# Altium project FMC_HPC_TO_LPC_BREAKOUT.PrjPcb
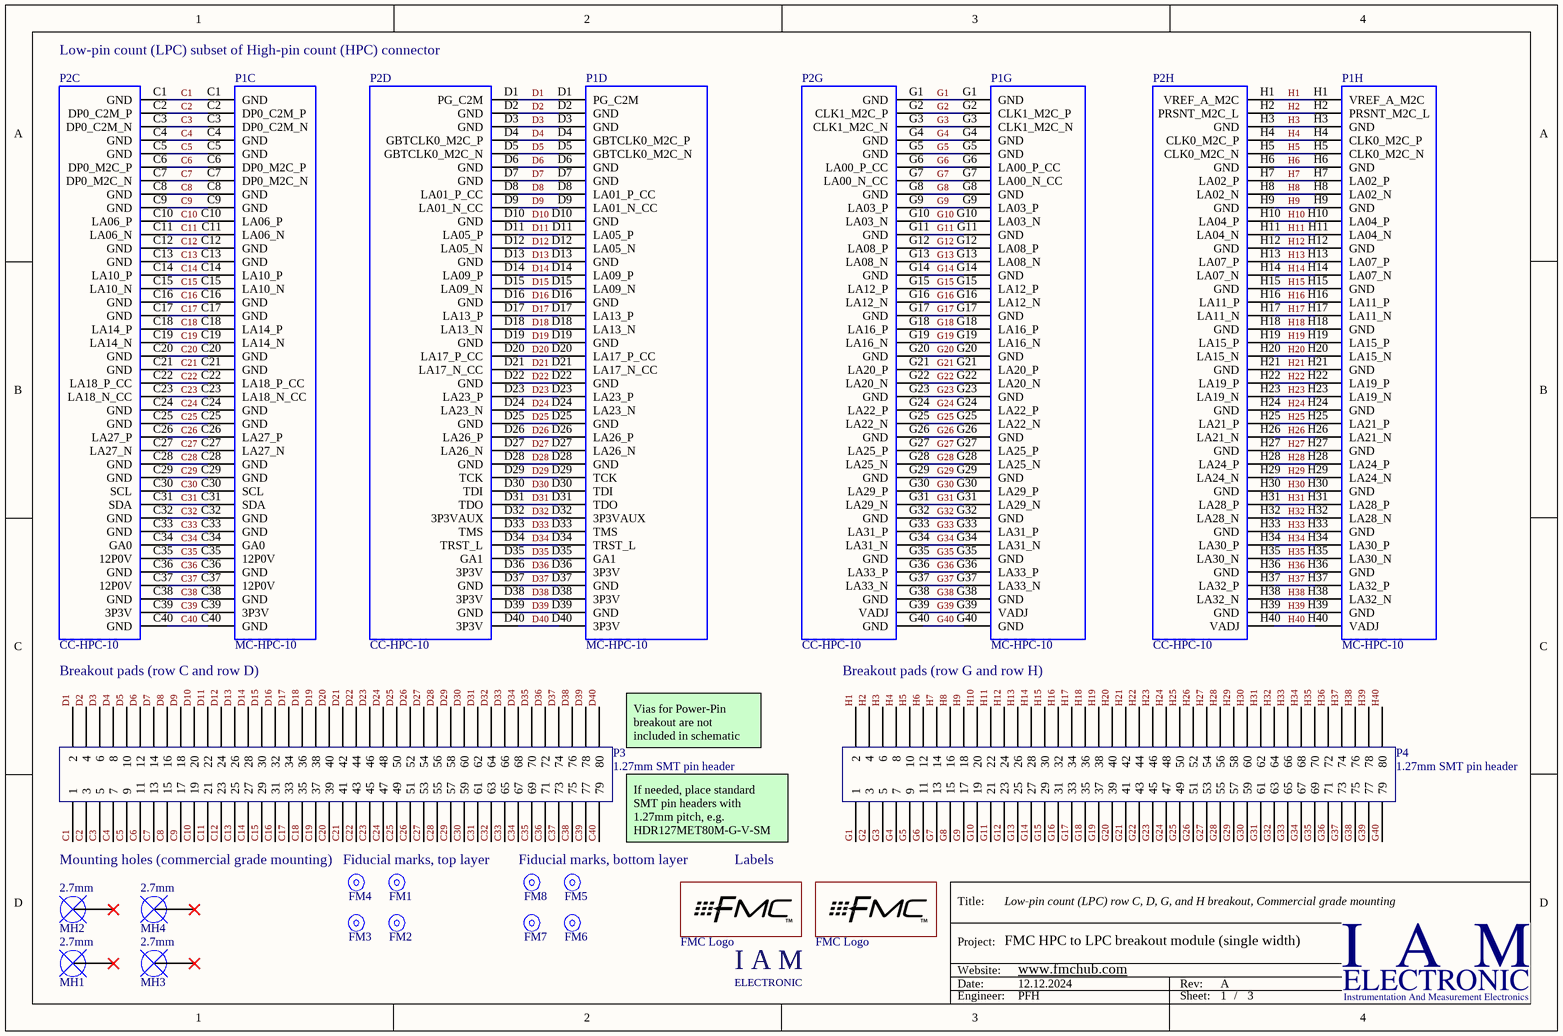
[diagram p0: FMC_HPC_TO_LPC_BREAKOUT_REVA.SchDoc]
3 sheets, 19 parts. Net scope: global (net labels, ports and power ports of the same name join across sheets).
Board file: FMC_HPC_TO_LPC_BREAKOUT.PcbDoc
Sheets:
  FMC_HPC_TO_LPC_BREAKOUT_REVA.SchDoc
  FMC_HPC_TO_LPC_BREAKOUT_ROW_HPC1.SchDoc
  FMC_HPC_TO_LPC_BREAKOUT_ROW_HPC2.SchDoc

## Sheet FMC_HPC_TO_LPC_BREAKOUT_REVA.SchDoc: Low-pin count (LPC) row C, D, G, and H breakout, Commercial grade mounting
size A4; Date: 12.12.2024; DrawnBy: PFH; Engineer: PFH; DocumentNumber: 1; Revision: A; SheetNumber: 1; SheetTotal: 3; Projekt: FMC HPC to LPC breakout module (single width); Website: www.fmchub.com; ProjectName: FMC_Single_LPC_BREAKOUT

### Parts
FM1  1mm  [FIDUCIAL_MARK_ROUND_RING]  (value not drawn)  (no BOM)
FM2  1mm  [FIDUCIAL_MARK_ROUND_RING]  (value not drawn)  (no BOM)
FM3  1mm  [FIDUCIAL_MARK_ROUND_RING]  (value not drawn)  (no BOM)
FM4  1mm  [FIDUCIAL_MARK_ROUND_RING]  (value not drawn)  (no BOM)
FM5  1mm  [FIDUCIAL_MARK_ROUND_RING]  (value not drawn)  (no BOM)
FM6  1mm  [FIDUCIAL_MARK_ROUND_RING]  (value not drawn)  (no BOM)
FM7  1mm  [FIDUCIAL_MARK_ROUND_RING]  (value not drawn)  (no BOM)
FM8  1mm  [FIDUCIAL_MARK_ROUND_RING]  (value not drawn)  (no BOM)
MH1  2.7mm  [Mounting_Hole_Plated_2.7mm - d3.1mm]  (no BOM)
MH2  2.7mm  [Mounting_Hole_Plated_2.7mm - d3.1mm]  (no BOM)
MH3  2.7mm  [Mounting_Hole_Plated_2.7mm-COVERED]  (no BOM)
MH4  2.7mm  [Mounting_Hole_Plated_2.7mm-COVERED]  (no BOM)
P1  MC-HPC-10  [ASP-134488-01]  (parts C,D,G,H of 10)
P2  CC-HPC-10  [ASP-134486-01]  (parts C,D,G,H of 10)
P3  1.27mm SMT pin header  [FTS-140-01-L-DV-A_NO_PASTE]
P4  1.27mm SMT pin header  [FTS-140-01-L-DV-A_NO_PASTE]
STR1  IAM LOGO  [IAM LOGO - MEDIUM]  (value not drawn)  (no BOM)
STR2  FMC Logo  [FMC_TM_LOGO_SMALL]  (no BOM)
STR3  FMC Logo  [FMC_TM_LOGO_SMALL]  (no BOM)

### Nets
C1: P1.C1(GND) P2.C1(GND) P3.1
C2: P1.C2(DP0_C2M_P) P2.C2(DP0_C2M_P) P3.3
C3: P1.C3(DP0_C2M_N) P2.C3(DP0_C2M_N) P3.5
C4: P1.C4(GND) P2.C4(GND) P3.7
C5: P1.C5(GND) P2.C5(GND) P3.9
C6: P1.C6(DP0_M2C_P) P2.C6(DP0_M2C_P) P3.11
C7: P1.C7(DP0_M2C_N) P2.C7(DP0_M2C_N) P3.13
C8: P1.C8(GND) P2.C8(GND) P3.15
C9: P1.C9(GND) P2.C9(GND) P3.17
C10: P1.C10(LA06_P) P2.C10(LA06_P) P3.19
C11: P1.C11(LA06_N) P2.C11(LA06_N) P3.21
C12: P1.C12(GND) P2.C12(GND) P3.23
C13: P1.C13(GND) P2.C13(GND) P3.25
C14: P1.C14(LA10_P) P2.C14(LA10_P) P3.27
C15: P1.C15(LA10_N) P2.C15(LA10_N) P3.29
C16: P1.C16(GND) P2.C16(GND) P3.31
C17: P1.C17(GND) P2.C17(GND) P3.33
C18: P1.C18(LA14_P) P2.C18(LA14_P) P3.35
C19: P1.C19(LA14_N) P2.C19(LA14_N) P3.37
C20: P1.C20(GND) P2.C20(GND) P3.39
C21: P1.C21(GND) P2.C21(GND) P3.41
C22: P1.C22(LA18_P_CC) P2.C22(LA18_P_CC) P3.43
C23: P1.C23(LA18_N_CC) P2.C23(LA18_N_CC) P3.45
C24: P1.C24(GND) P2.C24(GND) P3.47
C25: P1.C25(GND) P2.C25(GND) P3.49
C26: P1.C26(LA27_P) P2.C26(LA27_P) P3.51
C27: P1.C27(LA27_N) P2.C27(LA27_N) P3.53
C28: P1.C28(GND) P2.C28(GND) P3.55
C29: P1.C29(GND) P2.C29(GND) P3.57
C30: P1.C30(SCL) P2.C30(SCL) P3.59
C31: P1.C31(SDA) P2.C31(SDA) P3.61
C32: P1.C32(GND) P2.C32(GND) P3.63
C33: P1.C33(GND) P2.C33(GND) P3.65
C34: P1.C34(GA0) P2.C34(GA0) P3.67
C35: P1.C35(12P0V) P2.C35(12P0V) P3.69
C36: P1.C36(GND) P2.C36(GND) P3.71
C37: P1.C37(12P0V) P2.C37(12P0V) P3.73
C38: P1.C38(GND) P2.C38(GND) P3.75
C39: P1.C39(3P3V) P2.C39(3P3V) P3.77
C40: P1.C40(GND) P2.C40(GND) P3.79
D1: P1.D1(PG_C2M) P2.D1(PG_C2M) P3.2
D2: P1.D2(GND) P2.D2(GND) P3.4
D3: P1.D3(GND) P2.D3(GND) P3.6
D4: P1.D4(GBTCLK0_M2C_P) P2.D4(GBTCLK0_M2C_P) P3.8
D5: P1.D5(GBTCLK0_M2C_N) P2.D5(GBTCLK0_M2C_N) P3.10
D6: P1.D6(GND) P2.D6(GND) P3.12
D7: P1.D7(GND) P2.D7(GND) P3.14
D8: P1.D8(LA01_P_CC) P2.D8(LA01_P_CC) P3.16
D9: P1.D9(LA01_N_CC) P2.D9(LA01_N_CC) P3.18
D10: P1.D10(GND) P2.D10(GND) P3.20
D11: P1.D11(LA05_P) P2.D11(LA05_P) P3.22
D12: P1.D12(LA05_N) P2.D12(LA05_N) P3.24
D13: P1.D13(GND) P2.D13(GND) P3.26
D14: P1.D14(LA09_P) P2.D14(LA09_P) P3.28
D15: P1.D15(LA09_N) P2.D15(LA09_N) P3.30
D16: P1.D16(GND) P2.D16(GND) P3.32
D17: P1.D17(LA13_P) P2.D17(LA13_P) P3.34
D18: P1.D18(LA13_N) P2.D18(LA13_N) P3.36
D19: P1.D19(GND) P2.D19(GND) P3.38
D20: P1.D20(LA17_P_CC) P2.D20(LA17_P_CC) P3.40
D21: P1.D21(LA17_N_CC) P2.D21(LA17_N_CC) P3.42
D22: P1.D22(GND) P2.D22(GND) P3.44
D23: P1.D23(LA23_P) P2.D23(LA23_P) P3.46
D24: P1.D24(LA23_N) P2.D24(LA23_N) P3.48
D25: P1.D25(GND) P2.D25(GND) P3.50
D26: P1.D26(LA26_P) P2.D26(LA26_P) P3.52
D27: P1.D27(LA26_N) P2.D27(LA26_N) P3.54
D28: P1.D28(GND) P2.D28(GND) P3.56
D29: P1.D29(TCK) P2.D29(TCK) P3.58
D30: P1.D30(TDI) P2.D30(TDI) P3.60
D31: P1.D31(TDO) P2.D31(TDO) P3.62
D32: P1.D32(3P3VAUX) P2.D32(3P3VAUX) P3.64
D33: P1.D33(TMS) P2.D33(TMS) P3.66
D34: P1.D34(TRST_L) P2.D34(TRST_L) P3.68
D35: P1.D35(GA1) P2.D35(GA1) P3.70
D36: P1.D36(3P3V) P2.D36(3P3V) P3.72
D37: P1.D37(GND) P2.D37(GND) P3.74
D38: P1.D38(3P3V) P2.D38(3P3V) P3.76
D39: P1.D39(GND) P2.D39(GND) P3.78
D40: P1.D40(3P3V) P2.D40(3P3V) P3.80
G1: P1.G1(GND) P2.G1(GND) P4.1
G2: P1.G2(CLK1_M2C_P) P2.G2(CLK1_M2C_P) P4.3
G3: P1.G3(CLK1_M2C_N) P2.G3(CLK1_M2C_N) P4.5
G4: P1.G4(GND) P2.G4(GND) P4.7
G5: P1.G5(GND) P2.G5(GND) P4.9
G6: P1.G6(LA00_P_CC) P2.G6(LA00_P_CC) P4.11
G7: P1.G7(LA00_N_CC) P2.G7(LA00_N_CC) P4.13
G8: P1.G8(GND) P2.G8(GND) P4.15
G9: P1.G9(LA03_P) P2.G9(LA03_P) P4.17
G10: P1.G10(LA03_N) P2.G10(LA03_N) P4.19
G11: P1.G11(GND) P2.G11(GND) P4.21
G12: P1.G12(LA08_P) P2.G12(LA08_P) P4.23
G13: P1.G13(LA08_N) P2.G13(LA08_N) P4.25
G14: P1.G14(GND) P2.G14(GND) P4.27
G15: P1.G15(LA12_P) P2.G15(LA12_P) P4.29
G16: P1.G16(LA12_N) P2.G16(LA12_N) P4.31
G17: P1.G17(GND) P2.G17(GND) P4.33
G18: P1.G18(LA16_P) P2.G18(LA16_P) P4.35
G19: P1.G19(LA16_N) P2.G19(LA16_N) P4.37
G20: P1.G20(GND) P2.G20(GND) P4.39
G21: P1.G21(LA20_P) P2.G21(LA20_P) P4.41
G22: P1.G22(LA20_N) P2.G22(LA20_N) P4.43
G23: P1.G23(GND) P2.G23(GND) P4.45
G24: P1.G24(LA22_P) P2.G24(LA22_P) P4.47
G25: P1.G25(LA22_N) P2.G25(LA22_N) P4.49
G26: P1.G26(GND) P2.G26(GND) P4.51
G27: P1.G27(LA25_P) P2.G27(LA25_P) P4.53
G28: P1.G28(LA25_N) P2.G28(LA25_N) P4.55
G29: P1.G29(GND) P2.G29(GND) P4.57
G30: P1.G30(LA29_P) P2.G30(LA29_P) P4.59
G31: P1.G31(LA29_N) P2.G31(LA29_N) P4.61
G32: P1.G32(GND) P2.G32(GND) P4.63
G33: P1.G33(LA31_P) P2.G33(LA31_P) P4.65
G34: P1.G34(LA31_N) P2.G34(LA31_N) P4.67
G35: P1.G35(GND) P2.G35(GND) P4.69
G36: P1.G36(LA33_P) P2.G36(LA33_P) P4.71
G37: P1.G37(LA33_N) P2.G37(LA33_N) P4.73
G38: P1.G38(GND) P2.G38(GND) P4.75
G39: P1.G39(VADJ) P2.G39(VADJ) P4.77
G40: P1.G40(GND) P2.G40(GND) P4.79
H1: P1.H1(VREF_A_M2C) P2.H1(VREF_A_M2C) P4.2
H2: P1.H2(PRSNT_M2C_L) P2.H2(PRSNT_M2C_L) P4.4
H3: P1.H3(GND) P2.H3(GND) P4.6
H4: P1.H4(CLK0_M2C_P) P2.H4(CLK0_M2C_P) P4.8
H5: P1.H5(CLK0_M2C_N) P2.H5(CLK0_M2C_N) P4.10
H6: P1.H6(GND) P2.H6(GND) P4.12
H7: P1.H7(LA02_P) P2.H7(LA02_P) P4.14
H8: P1.H8(LA02_N) P2.H8(LA02_N) P4.16
H9: P1.H9(GND) P2.H9(GND) P4.18
H10: P1.H10(LA04_P) P2.H10(LA04_P) P4.20
H11: P1.H11(LA04_N) P2.H11(LA04_N) P4.22
H12: P1.H12(GND) P2.H12(GND) P4.24
H13: P1.H13(LA07_P) P2.H13(LA07_P) P4.26
H14: P1.H14(LA07_N) P2.H14(LA07_N) P4.28
H15: P1.H15(GND) P2.H15(GND) P4.30
H16: P1.H16(LA11_P) P2.H16(LA11_P) P4.32
H17: P1.H17(LA11_N) P2.H17(LA11_N) P4.34
H18: P1.H18(GND) P2.H18(GND) P4.36
H19: P1.H19(LA15_P) P2.H19(LA15_P) P4.38
H20: P1.H20(LA15_N) P2.H20(LA15_N) P4.40
H21: P1.H21(GND) P2.H21(GND) P4.42
H22: P1.H22(LA19_P) P2.H22(LA19_P) P4.44
H23: P1.H23(LA19_N) P2.H23(LA19_N) P4.46
H24: P1.H24(GND) P2.H24(GND) P4.48
H25: P1.H25(LA21_P) P2.H25(LA21_P) P4.50
H26: P1.H26(LA21_N) P2.H26(LA21_N) P4.52
H27: P1.H27(GND) P2.H27(GND) P4.54
H28: P1.H28(LA24_P) P2.H28(LA24_P) P4.56
H29: P1.H29(LA24_N) P2.H29(LA24_N) P4.58
H30: P1.H30(GND) P2.H30(GND) P4.60
H31: P1.H31(LA28_P) P2.H31(LA28_P) P4.62
H32: P1.H32(LA28_N) P2.H32(LA28_N) P4.64
H33: P1.H33(GND) P2.H33(GND) P4.66
H34: P1.H34(LA30_P) P2.H34(LA30_P) P4.68
H35: P1.H35(LA30_N) P2.H35(LA30_N) P4.70
H36: P1.H36(GND) P2.H36(GND) P4.72
H37: P1.H37(LA32_P) P2.H37(LA32_P) P4.74
H38: P1.H38(LA32_N) P2.H38(LA32_N) P4.76
H39: P1.H39(GND) P2.H39(GND) P4.78
H40: P1.H40(VADJ) P2.H40(VADJ) P4.80

Not connected (* = marked no-connect by the designer): FM1 FD0; FM2 FD0; FM3 FD0; FM4 FD0; FM5 FD0; FM6 FD0; FM7 FD0; FM8 FD0; MH1 0*; MH2 0*; MH3 0*; MH4 0*

### Notes on the sheet
- Low-pin count (LPC) subset of High-pin count (HPC) connector
- Breakout pads (row C and row D)
- Breakout pads (row G and row H)
- (near P3) Vias for Power-Pin
  breakout are not
  included in schematic
- If needed, place standard
  SMT pin headers with
  1.27mm pitch, e.g.
  HDR127MET80M-G-V-SM
- (near FM4) Mounting holes (commercial grade mounting)
- Fiducial marks, top layer
- Fiducial marks, bottom layer
- Labels
- Title:
- Project:
- Date:
- Website:
- Rev:
- Engineer:
- Sheet:
- /
- (in symbol IAM_LOGO) I A M; ELECTRONIC

### Library data of the parts
FM1-FM8 = Fiducial_Mark: Fiducial mark, width 1mm, clearance 3mm; Width: 1 mm; Clearance: 3 mm
MH1-MH4 = Mounting_Hole_2.7mm: Mounting hole, hole size 2.7mm; Hole radius: 2.7 mm; Diameter (plated): *; Keep out (radius): *; Plated: *
P1 = MC-HPC-10: MC-HPC-10, FMC High-pin count connector, lead free, 400 I/Os, male, 10 mm mated stack height; Manufacturer: Samtec; Manufacturer Ref: SEAM-40-03.5-S-10-2-A-K-TR-VITA57.0; Pitch: 1.27 mm; Mated Stack Height: 10 mm; Solder Type: Lead-Free; Number I/O: 400; PartName: ASP-134488-01; Part: ASP-134488-01; Vita PartNumber: MC-HPC-10; Pin Count: High; Gender: male; Supplier 1: Digi-Key; Supplier Part Number 1: SAM8730-ND
P2 = CC-HPC-10: CC-HPC-10, FMC High-pin count connector, lead free, 400 I/Os, female, 10 mm mated stack height; Manufacturer: Samtec; Manufacturer Ref: SEAF-40-06.5-10-A; Pitch: 1.27 mm; Mated Stack Height: 10 mm; Solder Type: Lead-Free; Number I/O: 400; PartName: ASP-134486-01; Part: ASP-134486-01; Vita PartNumber: CC-HPC-10; Pin Count: High; Gender: female; Supplier 1: Digi-Key; Supplier Part Number 1: SAM8728-ND
P3 = FTS-140-X-DV: 1.27 MM 80 PIN VERTICAL MALE HEADER; Part: FTS-140-01-L-DV-A; Manufacturer: Samtec; Part_2nd: HDR127MET80M-G-V-SM; Manufacturer_2nd: Chip Quik Inc.; Pitch: 1.27 mm
P4 = FTS-140-X-DV: 1.27 MM 80 PIN VERTICAL MALE HEADER; Part: FTS-140-01-L-DV-A; Manufacturer: Samtec; Manufacturer_2nd: Chip Quik Inc.; Part_2nd: HDR127MET80M-G-V-SM; Pitch: 1.27 mm
STR1 = IAM_LOGO: I A M E L E C T R O N I C - Logo; Layer: Top Overlay; Manufacturer: IAM ELECTRONIC; Part: Logo
STR2 STR3 = FMC_Logo: VITA FMC Logo

## Sheet FMC_HPC_TO_LPC_BREAKOUT_ROW_HPC1.SchDoc: High-pin count (HPC) row A, B, and C pass-through
size A4; Date: 12.12.2024; DrawnBy: PFH; Engineer: PFH; DocumentNumber: 1; Revision: A; SheetNumber: 2; SheetTotal: 3; Projekt: FMC HPC to LPC breakout module (single width); Website: www.fmchub.com; ProjectName: FMC_Single_LPC_BREAKOUT
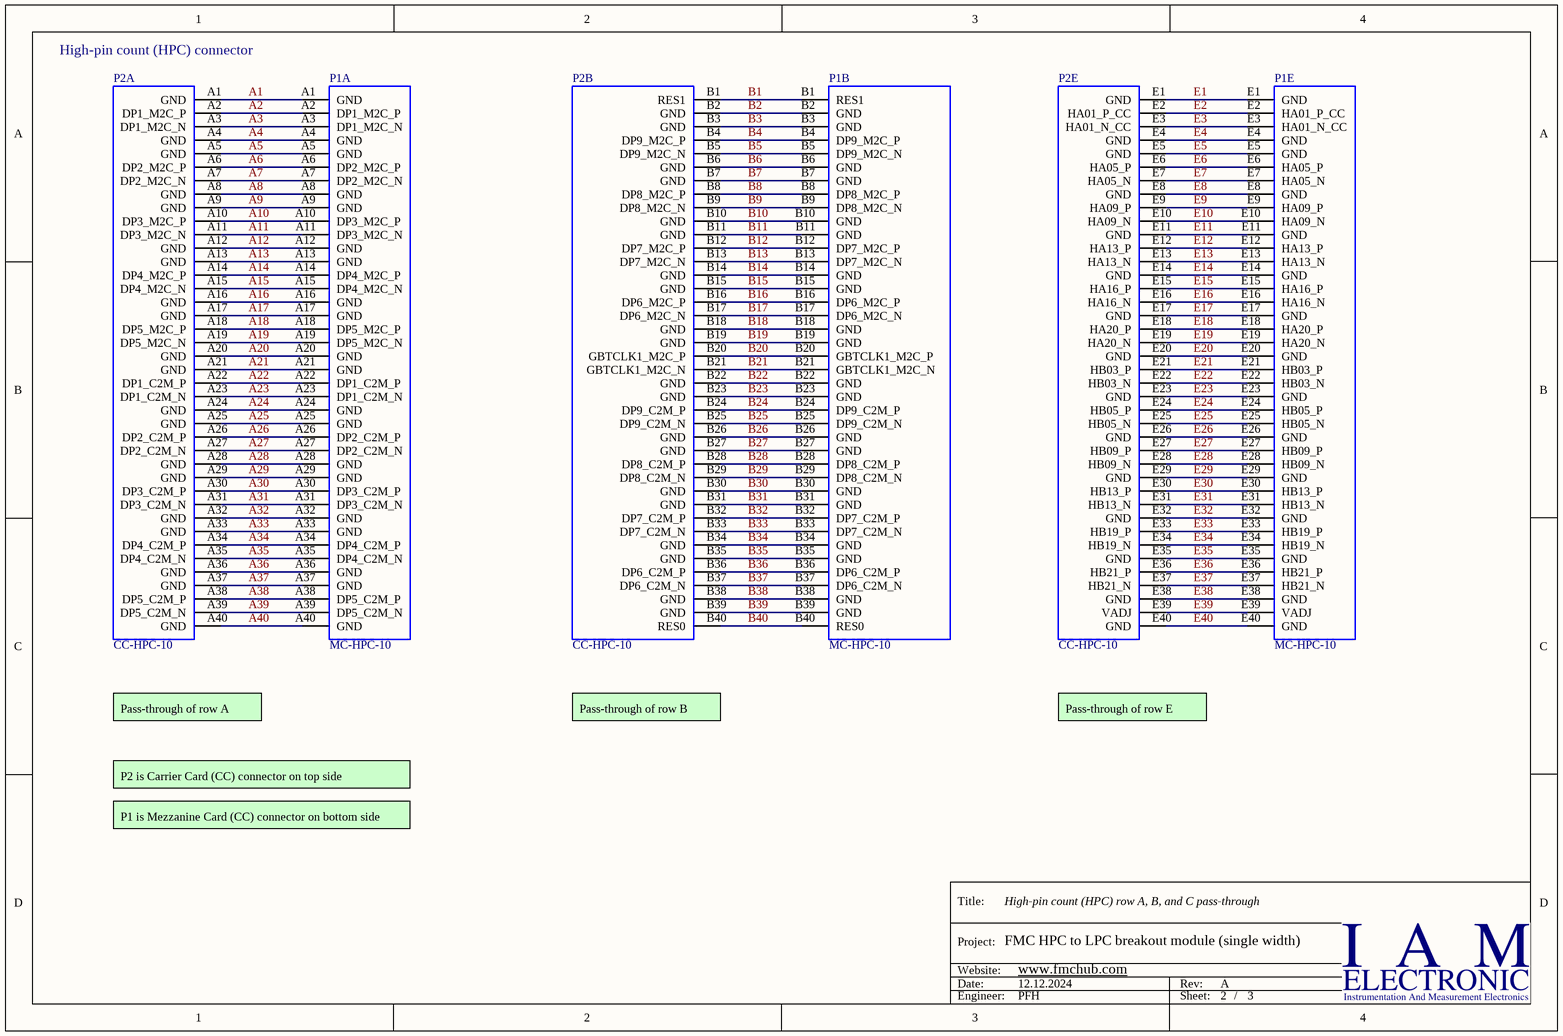
[diagram p1: FMC_HPC_TO_LPC_BREAKOUT_ROW_HPC1.SchDoc]

### Parts
P1  MC-HPC-10  [ASP-134488-01]  (parts A,B,E of 10)
P2  CC-HPC-10  [ASP-134486-01]  (parts A,B,E of 10)

### Nets
A1: P1.A1(GND) P2.A1(GND)
A2: P1.A2(DP1_M2C_P) P2.A2(DP1_M2C_P)
A3: P1.A3(DP1_M2C_N) P2.A3(DP1_M2C_N)
A4: P1.A4(GND) P2.A4(GND)
A5: P1.A5(GND) P2.A5(GND)
A6: P1.A6(DP2_M2C_P) P2.A6(DP2_M2C_P)
A7: P1.A7(DP2_M2C_N) P2.A7(DP2_M2C_N)
A8: P1.A8(GND) P2.A8(GND)
A9: P1.A9(GND) P2.A9(GND)
A10: P1.A10(DP3_M2C_P) P2.A10(DP3_M2C_P)
A11: P1.A11(DP3_M2C_N) P2.A11(DP3_M2C_N)
A12: P1.A12(GND) P2.A12(GND)
A13: P1.A13(GND) P2.A13(GND)
A14: P1.A14(DP4_M2C_P) P2.A14(DP4_M2C_P)
A15: P1.A15(DP4_M2C_N) P2.A15(DP4_M2C_N)
A16: P1.A16(GND) P2.A16(GND)
A17: P1.A17(GND) P2.A17(GND)
A18: P1.A18(DP5_M2C_P) P2.A18(DP5_M2C_P)
A19: P1.A19(DP5_M2C_N) P2.A19(DP5_M2C_N)
A20: P1.A20(GND) P2.A20(GND)
A21: P1.A21(GND) P2.A21(GND)
A22: P1.A22(DP1_C2M_P) P2.A22(DP1_C2M_P)
A23: P1.A23(DP1_C2M_N) P2.A23(DP1_C2M_N)
A24: P1.A24(GND) P2.A24(GND)
A25: P1.A25(GND) P2.A25(GND)
A26: P1.A26(DP2_C2M_P) P2.A26(DP2_C2M_P)
A27: P1.A27(DP2_C2M_N) P2.A27(DP2_C2M_N)
A28: P1.A28(GND) P2.A28(GND)
A29: P1.A29(GND) P2.A29(GND)
A30: P1.A30(DP3_C2M_P) P2.A30(DP3_C2M_P)
A31: P1.A31(DP3_C2M_N) P2.A31(DP3_C2M_N)
A32: P1.A32(GND) P2.A32(GND)
A33: P1.A33(GND) P2.A33(GND)
A34: P1.A34(DP4_C2M_P) P2.A34(DP4_C2M_P)
A35: P1.A35(DP4_C2M_N) P2.A35(DP4_C2M_N)
A36: P1.A36(GND) P2.A36(GND)
A37: P1.A37(GND) P2.A37(GND)
A38: P1.A38(DP5_C2M_P) P2.A38(DP5_C2M_P)
A39: P1.A39(DP5_C2M_N) P2.A39(DP5_C2M_N)
A40: P1.A40(GND) P2.A40(GND)
B1: P1.B1(RES1) P2.B1(RES1)
B2: P1.B2(GND) P2.B2(GND)
B3: P1.B3(GND) P2.B3(GND)
B4: P1.B4(DP9_M2C_P) P2.B4(DP9_M2C_P)
B5: P1.B5(DP9_M2C_N) P2.B5(DP9_M2C_N)
B6: P1.B6(GND) P2.B6(GND)
B7: P1.B7(GND) P2.B7(GND)
B8: P1.B8(DP8_M2C_P) P2.B8(DP8_M2C_P)
B9: P1.B9(DP8_M2C_N) P2.B9(DP8_M2C_N)
B10: P1.B10(GND) P2.B10(GND)
B11: P1.B11(GND) P2.B11(GND)
B12: P1.B12(DP7_M2C_P) P2.B12(DP7_M2C_P)
B13: P1.B13(DP7_M2C_N) P2.B13(DP7_M2C_N)
B14: P1.B14(GND) P2.B14(GND)
B15: P1.B15(GND) P2.B15(GND)
B16: P1.B16(DP6_M2C_P) P2.B16(DP6_M2C_P)
B17: P1.B17(DP6_M2C_N) P2.B17(DP6_M2C_N)
B18: P1.B18(GND) P2.B18(GND)
B19: P1.B19(GND) P2.B19(GND)
B20: P1.B20(GBTCLK1_M2C_P) P2.B20(GBTCLK1_M2C_P)
B21: P1.B21(GBTCLK1_M2C_N) P2.B21(GBTCLK1_M2C_N)
B22: P1.B22(GND) P2.B22(GND)
B23: P1.B23(GND) P2.B23(GND)
B24: P1.B24(DP9_C2M_P) P2.B24(DP9_C2M_P)
B25: P1.B25(DP9_C2M_N) P2.B25(DP9_C2M_N)
B26: P1.B26(GND) P2.B26(GND)
B27: P1.B27(GND) P2.B27(GND)
B28: P1.B28(DP8_C2M_P) P2.B28(DP8_C2M_P)
B29: P1.B29(DP8_C2M_N) P2.B29(DP8_C2M_N)
B30: P1.B30(GND) P2.B30(GND)
B31: P1.B31(GND) P2.B31(GND)
B32: P1.B32(DP7_C2M_P) P2.B32(DP7_C2M_P)
B33: P1.B33(DP7_C2M_N) P2.B33(DP7_C2M_N)
B34: P1.B34(GND) P2.B34(GND)
B35: P1.B35(GND) P2.B35(GND)
B36: P1.B36(DP6_C2M_P) P2.B36(DP6_C2M_P)
B37: P1.B37(DP6_C2M_N) P2.B37(DP6_C2M_N)
B38: P1.B38(GND) P2.B38(GND)
B39: P1.B39(GND) P2.B39(GND)
B40: P1.B40(RES0) P2.B40(RES0)
E1: P1.E1(GND) P2.E1(GND)
E2: P1.E2(HA01_P_CC) P2.E2(HA01_P_CC)
E3: P1.E3(HA01_N_CC) P2.E3(HA01_N_CC)
E4: P1.E4(GND) P2.E4(GND)
E5: P1.E5(GND) P2.E5(GND)
E6: P1.E6(HA05_P) P2.E6(HA05_P)
E7: P1.E7(HA05_N) P2.E7(HA05_N)
E8: P1.E8(GND) P2.E8(GND)
E9: P1.E9(HA09_P) P2.E9(HA09_P)
E10: P1.E10(HA09_N) P2.E10(HA09_N)
E11: P1.E11(GND) P2.E11(GND)
E12: P1.E12(HA13_P) P2.E12(HA13_P)
E13: P1.E13(HA13_N) P2.E13(HA13_N)
E14: P1.E14(GND) P2.E14(GND)
E15: P1.E15(HA16_P) P2.E15(HA16_P)
E16: P1.E16(HA16_N) P2.E16(HA16_N)
E17: P1.E17(GND) P2.E17(GND)
E18: P1.E18(HA20_P) P2.E18(HA20_P)
E19: P1.E19(HA20_N) P2.E19(HA20_N)
E20: P1.E20(GND) P2.E20(GND)
E21: P1.E21(HB03_P) P2.E21(HB03_P)
E22: P1.E22(HB03_N) P2.E22(HB03_N)
E23: P1.E23(GND) P2.E23(GND)
E24: P1.E24(HB05_P) P2.E24(HB05_P)
E25: P1.E25(HB05_N) P2.E25(HB05_N)
E26: P1.E26(GND) P2.E26(GND)
E27: P1.E27(HB09_P) P2.E27(HB09_P)
E28: P1.E28(HB09_N) P2.E28(HB09_N)
E29: P1.E29(GND) P2.E29(GND)
E30: P1.E30(HB13_P) P2.E30(HB13_P)
E31: P1.E31(HB13_N) P2.E31(HB13_N)
E32: P1.E32(GND) P2.E32(GND)
E33: P1.E33(HB19_P) P2.E33(HB19_P)
E34: P1.E34(HB19_N) P2.E34(HB19_N)
E35: P1.E35(GND) P2.E35(GND)
E36: P1.E36(HB21_P) P2.E36(HB21_P)
E37: P1.E37(HB21_N) P2.E37(HB21_N)
E38: P1.E38(GND) P2.E38(GND)
E39: P1.E39(VADJ) P2.E39(VADJ)
E40: P1.E40(GND) P2.E40(GND)

### Notes on the sheet
- (near P2) High-pin count (HPC) connector
- Pass-through of row A
- Pass-through of row B
- Pass-through of row E
- P2 is Carrier Card (CC) connector on top side
- P1 is Mezzanine Card (CC) connector on bottom side
- Title:
- Project:
- Date:
- Website:
- Rev:
- Engineer:
- Sheet:
- /

### Library data of the parts
P1 = MC-HPC-10: as P1 on sheet FMC_HPC_TO_LPC_BREAKOUT_REVA; PartName: ASP-134488-01; Part: ASP-134488-01; Vita PartNumber: MC-HPC-10; Pin Count: High; Gender: male; Supplier 1: Digi-Key; Supplier Part Number 1: SAM8730-ND
P2 = CC-HPC-10: as P2 on sheet FMC_HPC_TO_LPC_BREAKOUT_REVA; PartName: ASP-134486-01; Part: ASP-134486-01; Vita PartNumber: CC-HPC-10; Pin Count: High; Gender: female; Supplier 1: Digi-Key; Supplier Part Number 1: SAM8728-ND

## Sheet FMC_HPC_TO_LPC_BREAKOUT_ROW_HPC2.SchDoc: High-pin count (HPC) row F, J, and K pass-through
size A4; Date: 12.12.2024; DrawnBy: PFH; Engineer: PFH; DocumentNumber: 1; Revision: A; SheetNumber: 3; SheetTotal: 3; Projekt: FMC HPC to LPC breakout module (single width); Website: www.fmchub.com; ProjectName: FMC_Single_LPC_BREAKOUT
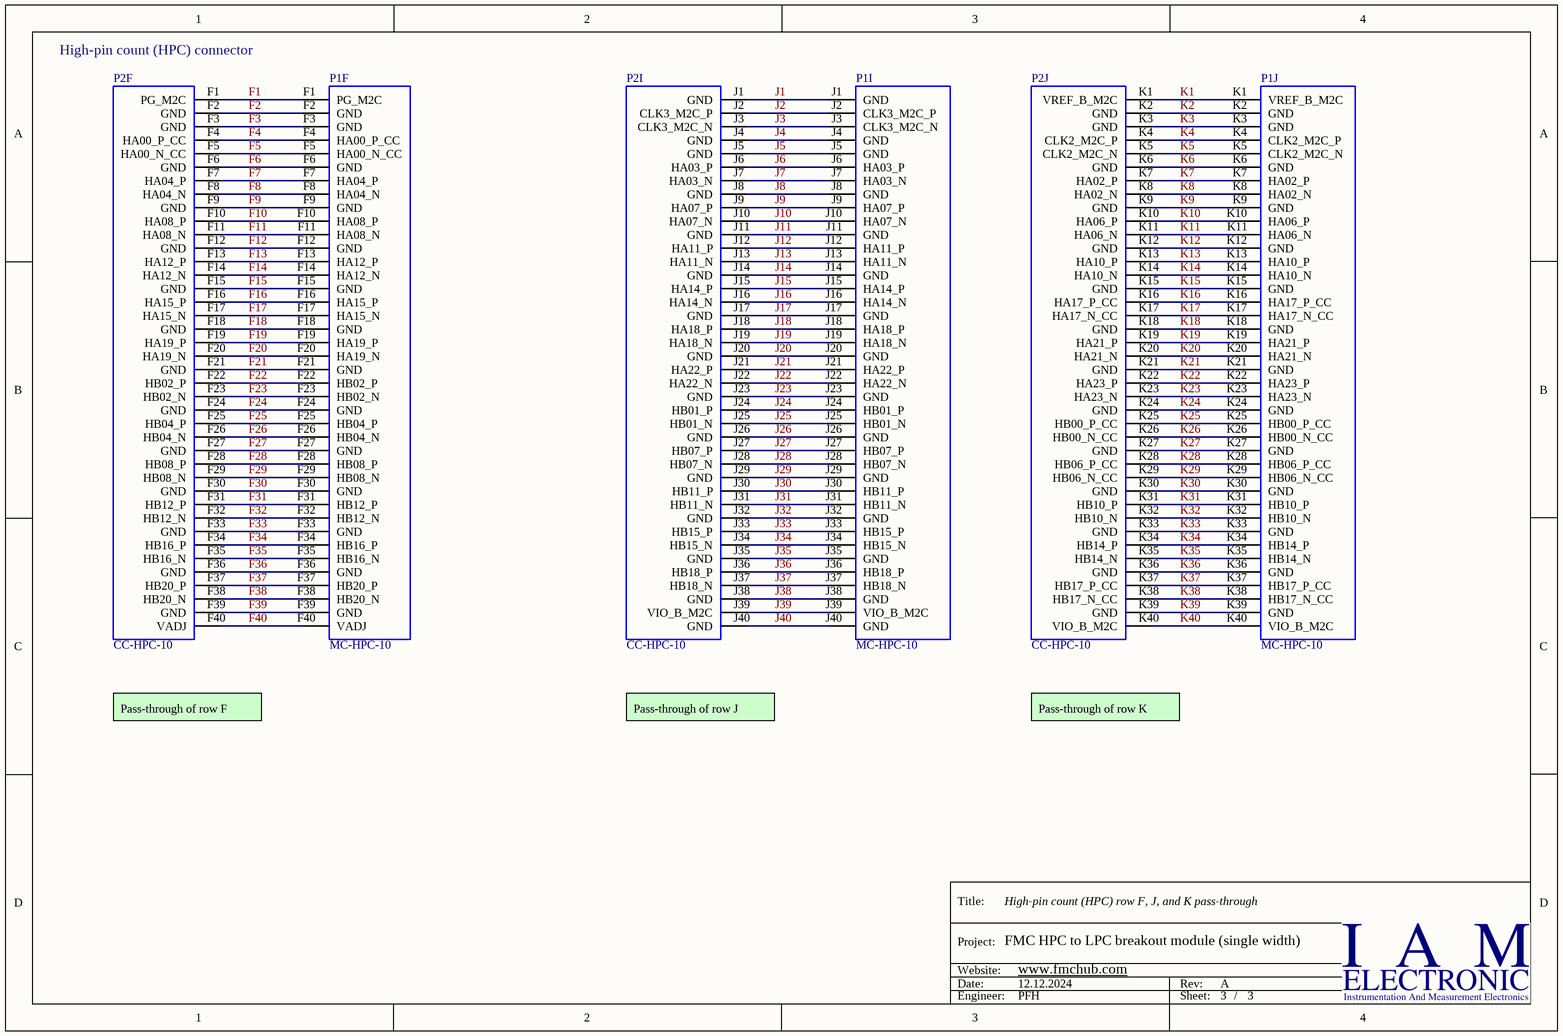
[diagram p2: FMC_HPC_TO_LPC_BREAKOUT_ROW_HPC2.SchDoc]

### Parts
P1  MC-HPC-10  [ASP-134488-01]  (parts F,I,J of 10)
P2  CC-HPC-10  [ASP-134486-01]  (parts F,I,J of 10)

### Nets
F1: P1.F1(PG_M2C) P2.F1(PG_M2C)
F2: P1.F2(GND) P2.F2(GND)
F3: P1.F3(GND) P2.F3(GND)
F4: P1.F4(HA00_P_CC) P2.F4(HA00_P_CC)
F5: P1.F5(HA00_N_CC) P2.F5(HA00_N_CC)
F6: P1.F6(GND) P2.F6(GND)
F7: P1.F7(HA04_P) P2.F7(HA04_P)
F8: P1.F8(HA04_N) P2.F8(HA04_N)
F9: P1.F9(GND) P2.F9(GND)
F10: P1.F10(HA08_P) P2.F10(HA08_P)
F11: P1.F11(HA08_N) P2.F11(HA08_N)
F12: P1.F12(GND) P2.F12(GND)
F13: P1.F13(HA12_P) P2.F13(HA12_P)
F14: P1.F14(HA12_N) P2.F14(HA12_N)
F15: P1.F15(GND) P2.F15(GND)
F16: P1.F16(HA15_P) P2.F16(HA15_P)
F17: P1.F17(HA15_N) P2.F17(HA15_N)
F18: P1.F18(GND) P2.F18(GND)
F19: P1.F19(HA19_P) P2.F19(HA19_P)
F20: P1.F20(HA19_N) P2.F20(HA19_N)
F21: P1.F21(GND) P2.F21(GND)
F22: P1.F22(HB02_P) P2.F22(HB02_P)
F23: P1.F23(HB02_N) P2.F23(HB02_N)
F24: P1.F24(GND) P2.F24(GND)
F25: P1.F25(HB04_P) P2.F25(HB04_P)
F26: P1.F26(HB04_N) P2.F26(HB04_N)
F27: P1.F27(GND) P2.F27(GND)
F28: P1.F28(HB08_P) P2.F28(HB08_P)
F29: P1.F29(HB08_N) P2.F29(HB08_N)
F30: P1.F30(GND) P2.F30(GND)
F31: P1.F31(HB12_P) P2.F31(HB12_P)
F32: P1.F32(HB12_N) P2.F32(HB12_N)
F33: P1.F33(GND) P2.F33(GND)
F34: P1.F34(HB16_P) P2.F34(HB16_P)
F35: P1.F35(HB16_N) P2.F35(HB16_N)
F36: P1.F36(GND) P2.F36(GND)
F37: P1.F37(HB20_P) P2.F37(HB20_P)
F38: P1.F38(HB20_N) P2.F38(HB20_N)
F39: P1.F39(GND) P2.F39(GND)
F40: P1.F40(VADJ) P2.F40(VADJ)
J1: P1.J1(GND) P2.J1(GND)
J2: P1.J2(CLK3_M2C_P) P2.J2(CLK3_M2C_P)
J3: P1.J3(CLK3_M2C_N) P2.J3(CLK3_M2C_N)
J4: P1.J4(GND) P2.J4(GND)
J5: P1.J5(GND) P2.J5(GND)
J6: P1.J6(HA03_P) P2.J6(HA03_P)
J7: P1.J7(HA03_N) P2.J7(HA03_N)
J8: P1.J8(GND) P2.J8(GND)
J9: P1.J9(HA07_P) P2.J9(HA07_P)
J10: P1.J10(HA07_N) P2.J10(HA07_N)
J11: P1.J11(GND) P2.J11(GND)
J12: P1.J12(HA11_P) P2.J12(HA11_P)
J13: P1.J13(HA11_N) P2.J13(HA11_N)
J14: P1.J14(GND) P2.J14(GND)
J15: P1.J15(HA14_P) P2.J15(HA14_P)
J16: P1.J16(HA14_N) P2.J16(HA14_N)
J17: P1.J17(GND) P2.J17(GND)
J18: P1.J18(HA18_P) P2.J18(HA18_P)
J19: P1.J19(HA18_N) P2.J19(HA18_N)
J20: P1.J20(GND) P2.J20(GND)
J21: P1.J21(HA22_P) P2.J21(HA22_P)
J22: P1.J22(HA22_N) P2.J22(HA22_N)
J23: P1.J23(GND) P2.J23(GND)
J24: P1.J24(HB01_P) P2.J24(HB01_P)
J25: P1.J25(HB01_N) P2.J25(HB01_N)
J26: P1.J26(GND) P2.J26(GND)
J27: P1.J27(HB07_P) P2.J27(HB07_P)
J28: P1.J28(HB07_N) P2.J28(HB07_N)
J29: P1.J29(GND) P2.J29(GND)
J30: P1.J30(HB11_P) P2.J30(HB11_P)
J31: P1.J31(HB11_N) P2.J31(HB11_N)
J32: P1.J32(GND) P2.J32(GND)
J33: P1.J33(HB15_P) P2.J33(HB15_P)
J34: P1.J34(HB15_N) P2.J34(HB15_N)
J35: P1.J35(GND) P2.J35(GND)
J36: P1.J36(HB18_P) P2.J36(HB18_P)
J37: P1.J37(HB18_N) P2.J37(HB18_N)
J38: P1.J38(GND) P2.J38(GND)
J39: P1.J39(VIO_B_M2C) P2.J39(VIO_B_M2C)
J40: P1.J40(GND) P2.J40(GND)
K1: P1.K1(VREF_B_M2C) P2.K1(VREF_B_M2C)
K2: P1.K2(GND) P2.K2(GND)
K3: P1.K3(GND) P2.K3(GND)
K4: P1.K4(CLK2_M2C_P) P2.K4(CLK2_M2C_P)
K5: P1.K5(CLK2_M2C_N) P2.K5(CLK2_M2C_N)
K6: P1.K6(GND) P2.K6(GND)
K7: P1.K7(HA02_P) P2.K7(HA02_P)
K8: P1.K8(HA02_N) P2.K8(HA02_N)
K9: P1.K9(GND) P2.K9(GND)
K10: P1.K10(HA06_P) P2.K10(HA06_P)
K11: P1.K11(HA06_N) P2.K11(HA06_N)
K12: P1.K12(GND) P2.K12(GND)
K13: P1.K13(HA10_P) P2.K13(HA10_P)
K14: P1.K14(HA10_N) P2.K14(HA10_N)
K15: P1.K15(GND) P2.K15(GND)
K16: P1.K16(HA17_P_CC) P2.K16(HA17_P_CC)
K17: P1.K17(HA17_N_CC) P2.K17(HA17_N_CC)
K18: P1.K18(GND) P2.K18(GND)
K19: P1.K19(HA21_P) P2.K19(HA21_P)
K20: P1.K20(HA21_N) P2.K20(HA21_N)
K21: P1.K21(GND) P2.K21(GND)
K22: P1.K22(HA23_P) P2.K22(HA23_P)
K23: P1.K23(HA23_N) P2.K23(HA23_N)
K24: P1.K24(GND) P2.K24(GND)
K25: P1.K25(HB00_P_CC) P2.K25(HB00_P_CC)
K26: P1.K26(HB00_N_CC) P2.K26(HB00_N_CC)
K27: P1.K27(GND) P2.K27(GND)
K28: P1.K28(HB06_P_CC) P2.K28(HB06_P_CC)
K29: P1.K29(HB06_N_CC) P2.K29(HB06_N_CC)
K30: P1.K30(GND) P2.K30(GND)
K31: P1.K31(HB10_P) P2.K31(HB10_P)
K32: P1.K32(HB10_N) P2.K32(HB10_N)
K33: P1.K33(GND) P2.K33(GND)
K34: P1.K34(HB14_P) P2.K34(HB14_P)
K35: P1.K35(HB14_N) P2.K35(HB14_N)
K36: P1.K36(GND) P2.K36(GND)
K37: P1.K37(HB17_P_CC) P2.K37(HB17_P_CC)
K38: P1.K38(HB17_N_CC) P2.K38(HB17_N_CC)
K39: P1.K39(GND) P2.K39(GND)
K40: P1.K40(VIO_B_M2C) P2.K40(VIO_B_M2C)

### Notes on the sheet
- (near P2) High-pin count (HPC) connector
- Pass-through of row F
- Pass-through of row J
- Pass-through of row K
- Title:
- Project:
- Date:
- Website:
- Rev:
- Engineer:
- Sheet:
- /

### Library data of the parts
P1 = MC-HPC-10: as P1 on sheet FMC_HPC_TO_LPC_BREAKOUT_REVA; PartName: ASP-134488-01; Part: ASP-134488-01; Vita PartNumber: MC-HPC-10; Pin Count: High; Gender: male; Supplier 1: Digi-Key; Supplier Part Number 1: SAM8730-ND
P2 = CC-HPC-10: as P2 on sheet FMC_HPC_TO_LPC_BREAKOUT_REVA; PartName: ASP-134486-01; Part: ASP-134486-01; Vita PartNumber: CC-HPC-10; Pin Count: High; Gender: female; Supplier 1: Digi-Key; Supplier Part Number 1: SAM8728-ND